# Altium schematic sheet STM32最小系统.SchDoc
size A3
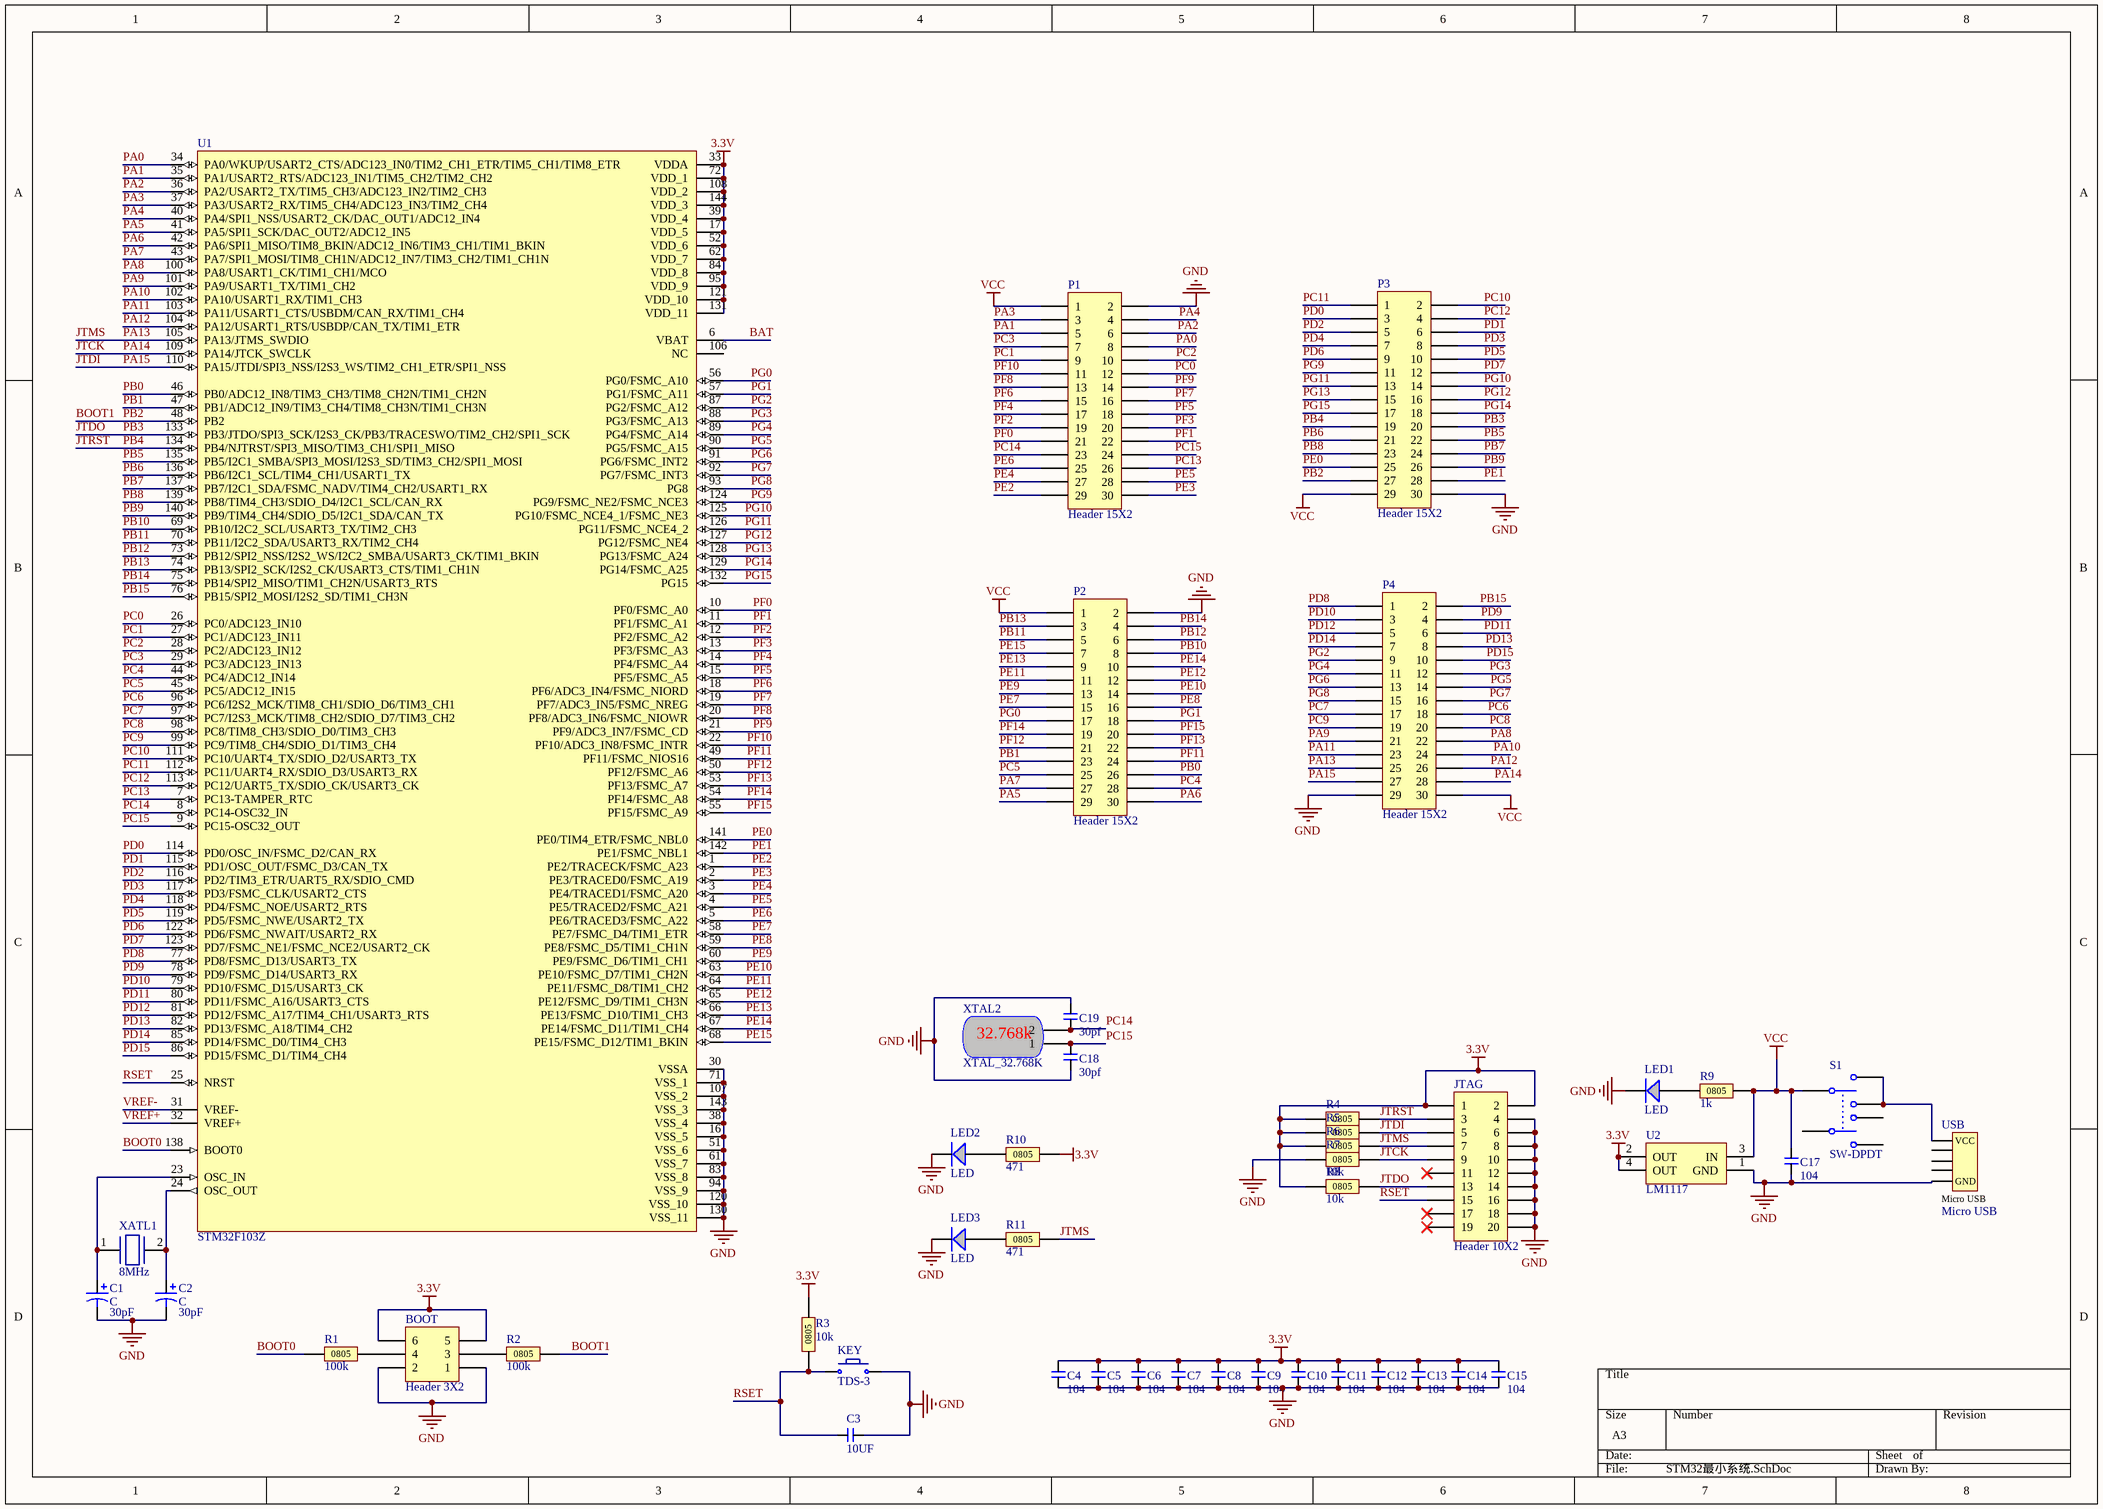
[diagram p0: STM32最小系统.SchDoc]

## Parts
BOOT  Header 3X2  [HDR2X3]
C1  C  value 30pF  [C0805]
C2  C  value 30pF  [C0805]
C3  10UF  [C0805]
C4  104  [C0805]
C5  104  [C0805]
C6  104  [C0805]
C7  104  [C0805]
C8  104  [C0805]
C9  104  [C0805]
C10  104  [C0805]
C11  104  [C0805]
C12  104  [C0805]
C13  104  [C0805]
C14  104  [C0805]
C15  104  [C0805]
C17  104  [C0805]
C18  30pf  [C0805]
C19  30pf  [C0805]
JTAG  Header 10X2  [JTAG - duplicate1]
KEY  TDS-3  [TDS-3]
LED1  LED  [LED]
LED2  LED  [LED]
LED3  LED  [LED]
P1  Header 15X2  [HDR2X15]
P2  Header 15X2  [HDR2X15]
P3  Header 15X2  [HDR2X15]
P4  Header 15X2  [HDR2X15]
R1  100k  [PCBComponent_1 - duplicate1]
R2  100k  [PCBComponent_1 - duplicate1]
R3  10k  [PCBComponent_1 - duplicate1]
R4  10k  [PCBComponent_1 - duplicate1]
R5  10k  [PCBComponent_1 - duplicate1]
R6  10k  [PCBComponent_1 - duplicate1]
R7  10k  [PCBComponent_1 - duplicate1]
R8  10k  [PCBComponent_1 - duplicate1]
R9  1k  [PCBComponent_1 - duplicate1]
R10  471  [PCBComponent_1 - duplicate1]
R11  471  [PCBComponent_1 - duplicate1]
S1  SW-DPDT  [DPDT-6]
U1  STM32F103Z  [LQFP-144N]
U2  LM1117  [SOT-223]
USB  Micro USB  [PCBComponent_1 - duplicate2]
XATL1  8MHz  [49/S_N]
XTAL2  XTAL_32.768K  [XTAL_32.768K]

## Nets
3.3V: BOOT.5 BOOT.6 C4.1 C5.1 C6.1 C7.1 C8.1 C9.1 C10.1 C11.1 C12.1 C13.1 C14.1 C15.1 JTAG.1 JTAG.2 R3.2 R4.1 R5.1 R6.1 R8.1 R10.2 U1.17(VDD_5) U1.33(VDDA) U1.39(VDD_4) U1.52(VDD_6) U1.62(VDD_7) U1.72(VDD_1) U1.84(VDD_8) U1.95(VDD_9) U1.108(VDD_2) U1.121(VDD_10) U1.131(VDD_11) U1.144(VDD_3) U2.2(OUT) U2.4(OUT)
GND: BOOT.1 BOOT.2 C1.2 C2.2 C3.1 C4.2 C5.2 C6.2 C7.2 C8.2 C9.2 C10.2 C11.2 C12.2 C13.2 C14.2 C15.2 C17.1 C18.1 C19.2 JTAG.4 JTAG.6 JTAG.8 JTAG.10 JTAG.12 JTAG.14 JTAG.16 JTAG.18 JTAG.20 KEY.2 LED1.2 LED2.2 LED3.2 P1.2 P2.2 P3.30 P4.29 R7.1 U1.16(VSS_5) U1.30(VSSA) U1.38(VSS_4) U1.51(VSS_6) U1.61(VSS_7) U1.71(VSS_1) U1.83(VSS_8) U1.94(VSS_9) U1.107(VSS_2) U1.120(VSS_10) U1.130(VSS_11) U1.143(VSS_3) U2.1(GND) USB.5(GND)
VCC: C17.2 P1.1 P2.1 P3.29 P4.30 R9.2 S1.1 U2.3(IN)
BAT: U1.6(VBAT)
BOOT0: R1.1 U1.138(BOOT0)
BOOT1: P3.27 R2.2 U1.48(PB2)  [also labelled PB2]
JTCK: JTAG.9 P4.28 R7.2 U1.109(PA14/JTCK_SWCLK)  [also labelled PA14]
JTDI: JTAG.5 P4.27 R5.2 U1.110(PA15/JTDI/SPI3_NSS/I2S3_WS/TIM2_CH1_ETR/SPI1_NSS)  [also labelled PA15]
JTDO: JTAG.13 P3.20 R8.2 U1.133(PB3/JTDO/SPI3_SCK/I2S3_CK/PB3/TRACESWO/TIM2_CH2/SPI1_SCK)  [also labelled PB3]
JTMS: JTAG.7 P4.25 R6.2 R11.2 U1.105(PA13/JTMS_SWDIO)  [also labelled PA13]
JTRST: JTAG.3 P3.19 R4.2 U1.134(PB4/NJTRST/SPI3_MISO/TIM3_CH1/SPI1_MISO)  [also labelled PB4]
PA0: P1.8 U1.34(PA0/WKUP/USART2_CTS/ADC123_IN0/TIM2_CH1_ETR/TIM5_CH1/TIM8_ETR)
PA1: P1.5 U1.35(PA1/USART2_RTS/ADC123_IN1/TIM5_CH2/TIM2_CH2)
PA2: P1.6 U1.36(PA2/USART2_TX/TIM5_CH3/ADC123_IN2/TIM2_CH3)
PA3: P1.3 U1.37(PA3/USART2_RX/TIM5_CH4/ADC123_IN3/TIM2_CH4)
PA4: P1.4 U1.40(PA4/SPI1_NSS/USART2_CK/DAC_OUT1/ADC12_IN4)
PA5: P2.29 U1.41(PA5/SPI1_SCK/DAC_OUT2/ADC12_IN5)
PA6: P2.30 U1.42(PA6/SPI1_MISO/TIM8_BKIN/ADC12_IN6/TIM3_CH1/TIM1_BKIN)
PA7: P2.27 U1.43(PA7/SPI1_MOSI/TIM8_CH1N/ADC12_IN7/TIM3_CH2/TIM1_CH1N)
PA8: P4.22 U1.100(PA8/USART1_CK/TIM1_CH1/MCO)
PA9: P4.21 U1.101(PA9/USART1_TX/TIM1_CH2)
PA10: P4.24 U1.102(PA10/USART1_RX/TIM1_CH3)
PA11: P4.23 U1.103(PA11/USART1_CTS/USBDM/CAN_RX/TIM1_CH4)
PA12: P4.26 U1.104(PA12/USART1_RTS/USBDP/CAN_TX/TIM1_ETR)
PB0: P2.26 U1.46(PB0/ADC12_IN8/TIM3_CH3/TIM8_CH2N/TIM1_CH2N)
PB1: P2.23 U1.47(PB1/ADC12_IN9/TIM3_CH4/TIM8_CH3N/TIM1_CH3N)
PB5: P3.22 U1.135(PB5/I2C1_SMBA/SPI3_MOSI/I2S3_SD/TIM3_CH2/SPI1_MOSI)
PB6: P3.21 U1.136(PB6/I2C1_SCL/TIM4_CH1/USART1_TX)
PB7: P3.24 U1.137(PB7/I2C1_SDA/FSMC_NADV/TIM4_CH2/USART1_RX)
PB8: P3.23 U1.139(PB8/TIM4_CH3/SDIO_D4/I2C1_SCL/CAN_RX)
PB9: P3.26 U1.140(PB9/TIM4_CH4/SDIO_D5/I2C1_SDA/CAN_TX)
PB10: P2.8 U1.69(PB10/I2C2_SCL/USART3_TX/TIM2_CH3)
PB11: P2.5 U1.70(PB11/I2C2_SDA/USART3_RX/TIM2_CH4)
PB12: P2.6 U1.73(PB12/SPI2_NSS/I2S2_WS/I2C2_SMBA/USART3_CK/TIM1_BKIN)
PB13: P2.3 U1.74(PB13/SPI2_SCK/I2S2_CK/USART3_CTS/TIM1_CH1N)
PB14: P2.4 U1.75(PB14/SPI2_MISO/TIM1_CH2N/USART3_RTS)
PB15: P4.2 U1.76(PB15/SPI2_MOSI/I2S2_SD/TIM1_CH3N)
PC0: P1.12 U1.26(PC0/ADC123_IN10)
PC1: P1.9 U1.27(PC1/ADC123_IN11)
PC2: P1.10 U1.28(PC2/ADC123_IN12)
PC3: P1.7 U1.29(PC3/ADC123_IN13)
PC4: P2.28 U1.44(PC4/ADC12_IN14)
PC5: P2.25 U1.45(PC5/ADC12_IN15)
PC6: P4.18 U1.96(PC6/I2S2_MCK/TIM8_CH1/SDIO_D6/TIM3_CH1)
PC7: P4.17 U1.97(PC7/I2S3_MCK/TIM8_CH2/SDIO_D7/TIM3_CH2)
PC8: P4.20 U1.98(PC8/TIM8_CH3/SDIO_D0/TIM3_CH3)
PC9: P4.19 U1.99(PC9/TIM8_CH4/SDIO_D1/TIM3_CH4)
PC10: P3.2 U1.111(PC10/UART4_TX/SDIO_D2/USART3_TX)
PC11: P3.1 U1.112(PC11/UART4_RX/SDIO_D3/USART3_RX)
PC12: P3.4 U1.113(PC12/UART5_TX/SDIO_CK/USART3_CK)
PC13: P1.26 U1.7(PC13-TAMPER_RTC)
PC14: C19.1 P1.23 U1.8(PC14-OSC32_IN) XTAL2.2
PC15: C18.2 P1.24 U1.9(PC15-OSC32_OUT) XTAL2.1
PD0: P3.3 U1.114(PD0/OSC_IN/FSMC_D2/CAN_RX)
PD1: P3.6 U1.115(PD1/OSC_OUT/FSMC_D3/CAN_TX)
PD2: P3.5 U1.116(PD2/TIM3_ETR/UART5_RX/SDIO_CMD)
PD3: P3.8 U1.117(PD3/FSMC_CLK/USART2_CTS)
PD4: P3.7 U1.118(PD4/FSMC_NOE/USART2_RTS)
PD5: P3.10 U1.119(PD5/FSMC_NWE/USART2_TX)
PD6: P3.9 U1.122(PD6/FSMC_NWAIT/USART2_RX)
PD7: P3.12 U1.123(PD7/FSMC_NE1/FSMC_NCE2/USART2_CK)
PD8: P4.1 U1.77(PD8/FSMC_D13/USART3_TX)
PD9: P4.4 U1.78(PD9/FSMC_D14/USART3_RX)
PD10: P4.3 U1.79(PD10/FSMC_D15/USART3_CK)
PD11: P4.6 U1.80(PD11/FSMC_A16/USART3_CTS)
PD12: P4.5 U1.81(PD12/FSMC_A17/TIM4_CH1/USART3_RTS)
PD13: P4.8 U1.82(PD13/FSMC_A18/TIM4_CH2)
PD14: P4.7 U1.85(PD14/FSMC_D0/TIM4_CH3)
PD15: P4.10 U1.86(PD15/FSMC_D1/TIM4_CH4)
PE0: P3.25 U1.141(PE0/TIM4_ETR/FSMC_NBL0)
PE1: P3.28 U1.142(PE1/FSMC_NBL1)
PE2: P1.29 U1.1(PE2/TRACECK/FSMC_A23)
PE3: P1.30 U1.2(PE3/TRACED0/FSMC_A19)
PE4: P1.27 U1.3(PE4/TRACED1/FSMC_A20)
PE5: P1.28 U1.4(PE5/TRACED2/FSMC_A21)
PE6: P1.25 U1.5(PE6/TRACED3/FSMC_A22)
PE7: P2.15 U1.58(PE7/FSMC_D4/TIM1_ETR)
PE8: P2.16 U1.59(PE8/FSMC_D5/TIM1_CH1N)
PE9: P2.13 U1.60(PE9/FSMC_D6/TIM1_CH1)
PE10: P2.14 U1.63(PE10/FSMC_D7/TIM1_CH2N)
PE11: P2.11 U1.64(PE11/FSMC_D8/TIM1_CH2)
PE12: P2.12 U1.65(PE12/FSMC_D9/TIM1_CH3N)
PE13: P2.9 U1.66(PE13/FSMC_D10/TIM1_CH3)
PE14: P2.10 U1.67(PE14/FSMC_D11/TIM1_CH4)
PE15: P2.7 U1.68(PE15/FSMC_D12/TIM1_BKIN)
PF0: P1.21 U1.10(PF0/FSMC_A0)
PF1: P1.22 U1.11(PF1/FSMC_A1)
PF2: P1.19 U1.12(PF2/FSMC_A2)
PF3: P1.20 U1.13(PF3/FSMC_A3)
PF4: P1.17 U1.14(PF4/FSMC_A4)
PF5: P1.18 U1.15(PF5/FSMC_A5)
PF6: P1.15 U1.18(PF6/ADC3_IN4/FSMC_NIORD)
PF7: P1.16 U1.19(PF7/ADC3_IN5/FSMC_NREG)
PF8: P1.13 U1.20(PF8/ADC3_IN6/FSMC_NIOWR)
PF9: P1.14 U1.21(PF9/ADC3_IN7/FSMC_CD)
PF10: P1.11 U1.22(PF10/ADC3_IN8/FSMC_INTR)
PF11: P2.24 U1.49(PF11/FSMC_NIOS16)
PF12: P2.21 U1.50(PF12/FSMC_A6)
PF13: P2.22 U1.53(PF13/FSMC_A7)
PF14: P2.19 U1.54(PF14/FSMC_A8)
PF15: P2.20 U1.55(PF15/FSMC_A9)
PG0: P2.17 U1.56(PG0/FSMC_A10)
PG1: P2.18 U1.57(PG1/FSMC_A11)
PG2: P4.9 U1.87(PG2/FSMC_A12)
PG3: P4.12 U1.88(PG3/FSMC_A13)
PG4: P4.11 U1.89(PG4/FSMC_A14)
PG5: P4.14 U1.90(PG5/FSMC_A15)
PG6: P4.13 U1.91(PG6/FSMC_INT2)
PG7: P4.16 U1.92(PG7/FSMC_INT3)
PG8: P4.15 U1.93(PG8)
PG9: P3.11 U1.124(PG9/FSMC_NE2/FSMC_NCE3)
PG10: P3.14 U1.125(PG10/FSMC_NCE4_1/FSMC_NE3)
PG11: P3.13 U1.126(PG11/FSMC_NCE4_2)
PG12: P3.16 U1.127(PG12/FSMC_NE4)
PG13: P3.15 U1.128(PG13/FSMC_A24)
PG14: P3.18 U1.129(PG14/FSMC_A25)
PG15: P3.17 U1.132(PG15)
RSET: C3.2 JTAG.15 KEY.1 R3.1 U1.25(NRST)
VREF+: U1.32(VREF+)
VREF-: U1.31(VREF-)
NetBOOT_3: BOOT.3 R2.1
NetBOOT_4: BOOT.4 R1.2
NetC1_1: C1.1 U1.23(OSC_IN) XATL1.1
NetC2_1: C2.1 U1.24(OSC_OUT) XATL1.2
NetLED1_1: LED1.1 R9.1
NetLED2_1: LED2.1 R10.1
NetLED3_1: LED3.1 R11.1
NetS1_2: S1.2 S1.3 USB.1(VCC)

Not connected (* = marked no-connect by the designer): JTAG 11* 17* 19*; S1 4 5 6; U1 106(NC); USB 2(VCC) 3(VCC) 4(VCC)

## Notes on the sheet
- (in symbol XTAL_32.768K) 32.768k
- (in symbol 贴片电阻) 0805

## Library data of the parts
BOOT = Header 3X2: Header, 3-Pin, Dual row; LatestRevisionDate: 17-Jul-2002; LatestRevisionNote: Re-released for DXP Platform.; Publisher: Altium Limited
C1 C2 = Cap Pol3: Polarized Capacitor (Surface Mount); Published: 8-Jun-2000; LatestRevisionDate: 29-May-2009; LatestRevisionNote: IPC-7351 Footprint Added.; PackageReference: C0805; Publisher: Altium Limited; PackageDescription: Chip Capacitor
C3-C15 C17-C19 = Cap_0805
JTAG = Header 10X2: Header, 10-Pin, Dual row; LatestRevisionDate: 17-Jul-2002; LatestRevisionNote: Re-released for DXP Platform.; Publisher: Altium Limited
P1-P4 = Header 15X2: Header, 15-Pin, Dual row; LatestRevisionDate: 17-Jul-2002; LatestRevisionNote: Re-released for DXP Platform.; Publisher: Altium Limited
R1-R11 = 贴片电阻
S1 = SW-DPDT: Double-Pole, Double-Throw Switch; Published: 24-Mar-1999; LatestRevisionDate: 17-Jul-2002; LatestRevisionNote: Re-released for DXP Platform.; PackageReference: DPDT-6; Publisher: Altium Limited; PackageDescription: Switch; 6 Leads
U1 = STM32F103Z_T: High-density performance line ARM®-based 32-bit MCU with 256 to 512KB  Flash, USB, CAN, 11 timers, 3 ADCs, 13 communication interfaces
XATL1 = XATL